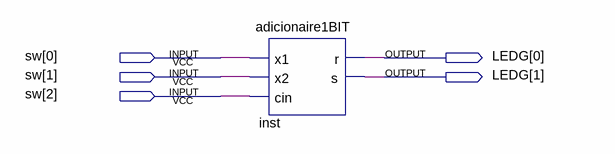
[diagram p0: schematic sheet]
// Quartus schematic adicionaire1.bdf as structural Verilog: 1 symbols, 5 pins
module adicionaire1 (
  input  [2:0] sw,
  output [1:0] LEDG
);

  adicionaire1BIT inst (.x1(sw[0]), .x2(sw[1]), .cin(sw[2]), .r(LEDG[0]), .s(LEDG[1]));
endmodule
